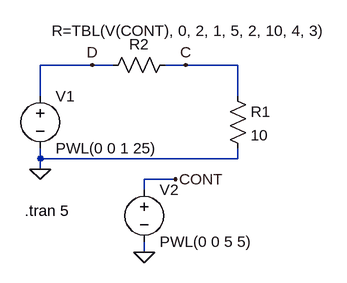
[diagram p0: schematic Fig_2-65_BR-TABLE-V.asc]
Fig_2-65_BR-TABLE-V.asc, the LTspice schematic file:
Version 4
SHEET 1 880 680
WIRE 128 96 48 96
WIRE 160 96 128 96
WIRE 272 96 240 96
WIRE 352 96 272 96
WIRE 48 144 48 96
WIRE 352 144 352 96
WIRE 48 240 48 224
WIRE 352 240 352 224
WIRE 352 240 48 240
WIRE 48 256 48 240
WIRE 256 272 208 272
WIRE 208 288 208 272
WIRE 208 384 208 368
FLAG 48 256 0
FLAG 208 384 0
FLAG 256 272 CONT
FLAG 128 96 D
FLAG 272 96 C
SYMBOL voltage 48 128 R0
WINDOW 123 0 0 Left 0
WINDOW 39 0 0 Left 0
SYMATTR InstName V1
SYMATTR Value PWL(0 0 1 25)
SYMBOL res 336 128 R0
SYMATTR InstName R1
SYMATTR Value 10
SYMBOL res 144 112 R270
WINDOW 0 32 56 VTop 2
WINDOW 3 84 133 VBottom 2
SYMATTR InstName R2
SYMATTR Value R=TBL(V(CONT), 0, 2, 1, 5, 2, 10, 4, 3)
SYMBOL voltage 208 272 R0
WINDOW 123 0 0 Left 0
WINDOW 39 0 0 Left 0
SYMATTR InstName V2
SYMATTR Value PWL(0 0 5 5)
TEXT 24 320 Left 2 !.tran 5

The netlist it stands for:
* Fig_2-65_BR-TABLE-V.asc
V1 D 0 PWL(0 0 1 25)
R1 C 0 10
R2 D C R=TBL(V(CONT), 0, 2, 1, 5, 2, 10, 4, 3)
V2 CONT 0 PWL(0 0 5 5)
.tran 5
.backanno
.end